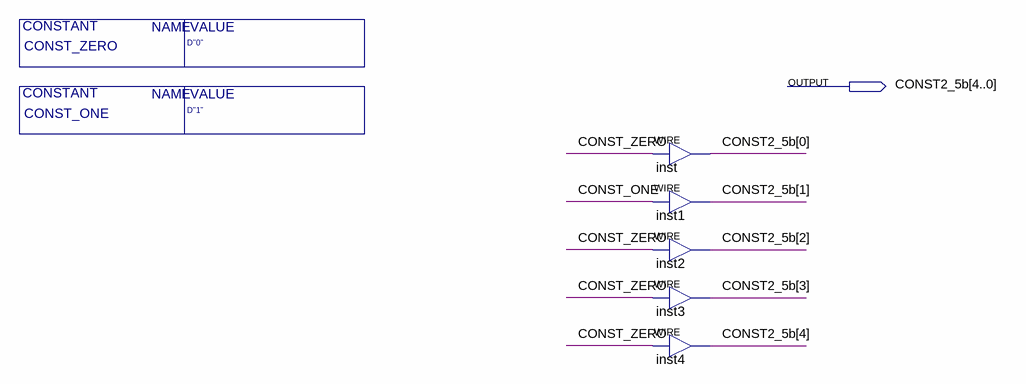
[diagram p0: schematic sheet]
// Quartus schematic CONST2_5b.bdf as structural Verilog: 5 symbols, 1 pins
module CONST2_5b #(parameter CONST_ZERO = "D\"0\"", parameter CONST_ONE = "D\"1\"") (
  output [4:0] CONST2_5b
);

  wire CONST_ONE, CONST_ZERO;

  assign CONST2_5b[0] = CONST_ZERO;  // WIRE inst
  assign CONST2_5b[1] = CONST_ONE;  // WIRE inst1
  assign CONST2_5b[2] = CONST_ZERO;  // WIRE inst2
  assign CONST2_5b[3] = CONST_ZERO;  // WIRE inst3
  assign CONST2_5b[4] = CONST_ZERO;  // WIRE inst4
endmodule
